# Altium schematic sheet 2.POWER.SchDoc
size A4
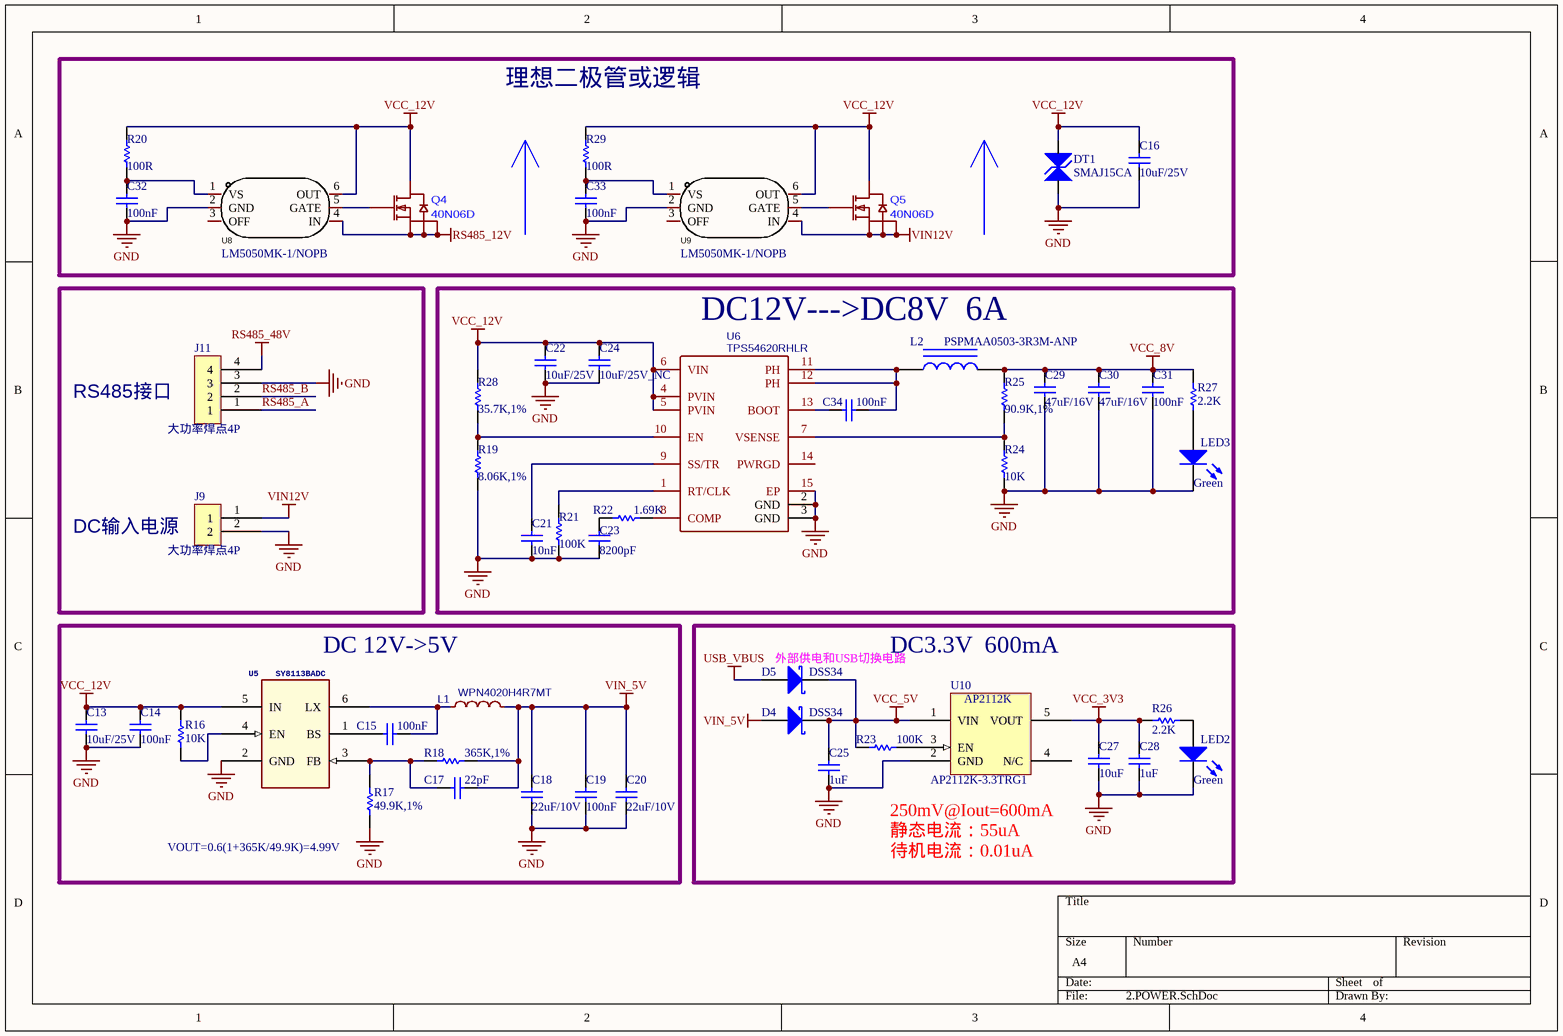
[diagram p0: 2.POWER.SchDoc]

## Parts
C13  10uF/25V  [0805C]
C14  100nF  [0402]
C15  100nF  [0402]
C16  10uF/25V  [0805C]
C17  22pF  [0402]
C18  22uF/10V  [0603]
C19  100nF  [0402]
C20  22uF/10V  [0603]
C21  10nF  [0402]
C22  10uF/25V  [0805C]
C23  8200pF  [0402]
C24  10uF/25V_NC  [0805C]
C25  1uF  [0402]
C27  10uF  [0402]
C28  1uF  [0402]
C29  47uF/16V  [1206C]
C30  47uF/16V  [1206C]
C31  100nF  [0402]
C32  100nF  [0402]
C33  100nF  [0402]
C34  100nF  [0402]
D4  DSS34  [SOD-123_L2.8-W1.8-LS3.7-RD]
D5  DSS34  [SOD-123_L2.8-W1.8-LS3.7-RD]
DT1  SMAJ15CA  [SMA_L4.3-W2.6-LS5.0-BI]
J9  大功率焊点4P  [CONN-TH_P3.5-2P]
J11  大功率焊点4P  [CONN-TH_P3.5_4P]
L1  WPN4020H4R7MT  [IND-SMD_L4.0-W4.0]
L2  PSPMAA0503-3R3M-ANP  [IND-SMD_L5.4-W5.2_PSPMAA0503]
LED2  Green  [LED0402]
LED3  Green  [LED0402]
Q4  40N06D  [WDFN-5_L3.3-W3.3-P0.65-BL]
Q5  40N06D  [WDFN-5_L3.3-W3.3-P0.65-BL]
R16  10K  [0402]
R17  49.9K,1%  [0402]
R18  365K,1%  [0402]
R19  8.06K,1%  [0402]
R20  100R  [0402]
R21  100K  [0402]
R22  1.69K  [0402]
R23  100K  [0402]
R24  10K  [0402]
R25  90.9K,1%  [0402]
R26  2.2K  [0402]
R27  2.2K  [0402]
R28  35.7K,1%  [0402]
R29  100R  [0402]
U5  SY8113BADC  [SOT23-6]
U6  TPS54620RHLR  [VQFN-14_L3.5-W3.5-P0.50-TL-EP_TPS54622RHLT]
U8  LM5050MK-1/NOPB  [TSOT-23-6_L2.9-W1.6-P0.95-LS2.8-BR]
U9  LM5050MK-1/NOPB  [TSOT-23-6_L2.9-W1.6-P0.95-LS2.8-BR]
U10  AP2112K-3.3TRG1  [SOT23-5]

## Blocks framed on the sheet
理想二极管或逻辑: C16 C32 C33 DT1 Q4 Q5 R20 R29 U8 U9
DC12V--->DC8V  6A: C21-C24 C29-C31 C34 L2 LED3 R19 R21 R22 R24 R25 R27 R28 U6
DC 12V->5V: C13-C15 C17-C20 L1 R16-R18 U5
DC3.3V  600mA: C25 C27 C28 D4 D5 LED2 R23 R26 U10

## Nets
GND: C13.2 C14.1 C16.2 C18.2 C19.2 C20.2 C21.1 C22.2 C23.1 C24.2 C25.2 C27.1 C28.1 C29.2 C30.2 C31.1 C32.1 C33.1 DT1.1 J9.2 J11.3 LED2.2(K) LED3.2(K) R17.2 R19.2 R21.2 R24.2 U5.2(GND) U6.2(GND) U6.3(GND) U6.15(EP) U8.2(GND) U9.2(GND) U10.2(GND)
RS485_12V: Q4.1(S) Q4.2(S) Q4.3(S) U8.4(IN)
RS485_48V: J11.4
USB_VBUS: D5.1(A)
VCC_3V3: C27.2 C28.2 R26.2 U10.5(VOUT)
VCC_5V: C25.1 D4.2(K) D5.2(K) R23.1 U10.1(VIN)
VCC_8V: C29.1 C30.1 C31.2 L2.2 R25.1 R27.2
VCC_12V: C13.1 C14.2 C16.1 C22.1 C24.1 DT1.2 Q4.5(D) Q5.5(D) R16.2 R20.1 R28.1 R29.1 U5.5(IN) U6.4(PVIN) U6.5(PVIN) U6.6(VIN) U8.6(OUT) U9.6(OUT)
VIN12V: J9.1 Q5.1(S) Q5.2(S) Q5.3(S) U9.4(IN)
VIN_5V: C17.1 C18.1 C19.1 C20.1 D4.1(A) L1.2 R18.1
RS485_A: J11.1
RS485_B: J11.2
NetC15_1: C15.1 L1.1 U5.6(LX)
NetC15_2: C15.2 U5.1(BS)
NetC17_2: C17.2 R17.1 R18.2 U5.3(FB)
NetC21_2: C21.2 U6.9(SS/TR)
NetC23_2: C23.2 R22.1
NetC32_2: C32.2 R20.2 U8.1(VS)
NetC33_2: C33.2 R29.2 U9.1(VS)
NetC34_1: C34.1 U6.13(BOOT)
NetC34_2: C34.2 L2.1 U6.11(PH) U6.12(PH)
NetLED2_1: LED2.1(A) R26.1
NetLED3_1: LED3.1(A) R27.1
NetQ4_4: Q4.4(G) U8.5(GATE)
NetQ5_4: Q5.4(G) U9.5(GATE)
NetR16_1: R16.1 U5.4(EN)
NetR19_1: R19.1 R28.2 U6.10(EN)
NetR21_1: R21.1 U6.1(RT/CLK)
NetR22_2: R22.2 U6.8(COMP)
NetR23_2: R23.2 U10.3(EN)
NetR24_1: R24.1 R25.2 U6.7(VSENSE)

Not connected (* = marked no-connect by the designer): U6 14(PWRGD); U8 3(OFF); U9 3(OFF); U10 4(N/C)

## Notes on the sheet
- RS485接口
- DC输入电源
- (near D5) 外部供电和USB切换电路
- (near R17) VOUT=0.6(1+365K/49.9K)=4.99V
- 250mV@Iout=600mA
- 静态电流：55uA
- 待机电流：0.01uA
- (in symbol AP2112) AP2112K

## Library data of the parts
C13-C25 C27-C34 = Cap: Capacitor; PartNumber: CAP100NF; Published: 8-Jun-2000; LatestRevisionDate: 17-Jul-2002; LatestRevisionNote: Re-released for DXP Platform.; PackageReference: 0402; Publisher: Altium Limited
  C13 C16 C22: Value: 10uF/25V
  C14 C15 C19 C31-C34: Value: 100nF
  C17: Value: 22pF
  C18 C20: Value: 22uF/10V
  C21: Value: 10nF
  C23: Value: 8200pF
  C24: Value: 10uF/25V_NC
  C25 C28: Value: 1uF
  C27: Value: 10uF
  C29 C30: Value: 47uF/16V
D4 D5 = D Schottky: Schottky Diode; Published: 8-Jun-2000; LatestRevisionDate: 17-Jul-2002; LatestRevisionNote: Re-released for DXP Platform.; PackageReference: SMB; Publisher: Altium Limited; PackageDescription: DO-214-AA/SMB; 2 C-Bend Leads; Body 5.3 x 3.6 mm, inc. leads (LxW); Code_JEDEC: DO-214-AA; Value: DSS34
DT1 = 1110503009: 存货名称: TVS管; Value: SMAJ15CA
J9 = SIP2
J11 = SIP4
L1 = 2.2uH: BOM_Manufacturer: Sunlord; nameAlias: Inductance; BOM_Supplier: LCSC; BOM_Supplier Part: C98363; BOM_JLCPCB Part Class: Extended Part; spicePre: L
L2 = 0603 3.9nH 0.3nH: 贴片电感; ComponentLink1Description: 供应商链接; ComponentLink1URL: http://www.szlcsc.com/product/details_14473.html; Supplier: LC; SuppliersPartNumber: C436534; Value: PSPMAA0503-3R3M-ANP
LED2 LED3 = LED2: Typical RED, GREEN, YELLOW, AMBER GaAs LED; Published: 8-Jun-2000; LatestRevisionDate: 17-Jul-2002; LatestRevisionNote: Re-released for DXP Platform.; PackageVersion: Feb-2002; PackageReference: 3.2X1.6X1.1; Publisher: Altium Limited; PackageDescription: SM LED; 2 Flat Leads; Value: Green
R16-R18 R26 = Res1: Resistor; PartNumber: RES2.2K; Published: 8-Jun-2000; LatestRevisionDate: 17-Jul-2002; LatestRevisionNote: Re-released for DXP Platform.; PackageReference: 0402; Publisher: Altium Limited
  R16: Value: 10K
  R17: Value: 49.9K,1%
  R18: Value: 365K,1%
  R26: Value: 2.2K
R19-R25 R28 R29 = Res1: Resistor; PartNumber: RES22R; Published: 8-Jun-2000; LatestRevisionDate: 17-Jul-2002; LatestRevisionNote: Re-released for DXP Platform.; PackageReference: 0402; Publisher: Altium Limited
  R19: Value: 8.06K,1%
  R20 R29: Value: 100R
  R21 R23: Value: 100K
  R22: Value: 1.69K
  R24: Value: 10K
  R25: Value: 90.9K,1%
  R28: Value: 35.7K,1%
R27 = Res1: Resistor; PartNumber: RES22.1K; Published: 8-Jun-2000; LatestRevisionDate: 17-Jul-2002; LatestRevisionNote: Re-released for DXP Platform.; PackageReference: 0402; Publisher: Altium Limited; Value: 2.2K
U5 = SY81XX: Part Type: IC DC-DC
U6 = TPS54620RHLR: BOM_Manufacturer: Texas Instruments; Contributor: LCSC; BOM_Supplier: LCSC; BOM_Supplier Part: C263274; BOM_Manufacturer Part: TPS54620RHLR; BOM_JLCPCB Part Class: Extended Part; spicePre: U; spiceSymbolName: TPS54620RHLR
U8 U9 = LM5050MK-1/NOPB: Designer: U?; Symbol: LM5050MK-1/NOPB; Device: LM5050MK-1/NOPB; JLC NO: C129323
U10 = AP2112: Value: AP2112K-3.3TRG1
Q4 Q5 = 40N06D: JLC NO: C7543836